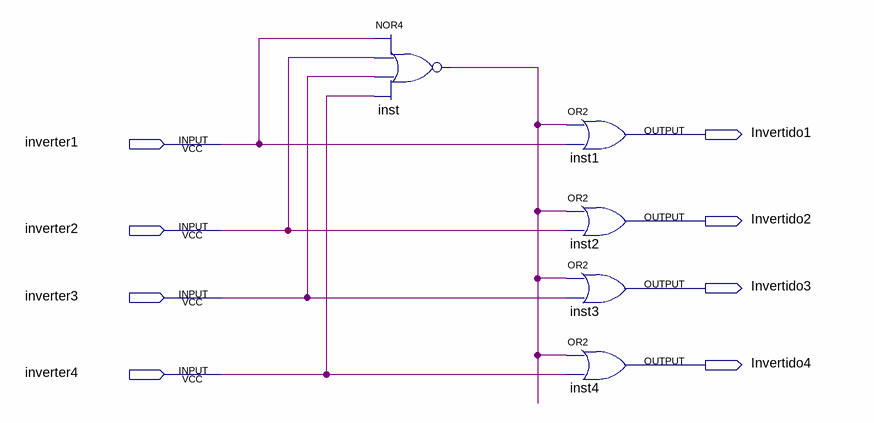
[diagram p0: schematic sheet]
// Quartus schematic InversorPositivo.bdf as structural Verilog: 5 symbols, 8 pins
module InversorPositivo (
  input  inverter1,
  input  inverter2,
  input  inverter3,
  input  inverter4,
  output Invertido1,
  output Invertido2,
  output Invertido3,
  output Invertido4
);

  wire inst_out;

  nor inst (inst_out, inverter1, inverter2, inverter3, inverter4);
  or inst1 (Invertido1, inst_out, inverter1);
  or inst2 (Invertido2, inst_out, inverter2);
  or inst3 (Invertido3, inst_out, inverter3);
  or inst4 (Invertido4, inst_out, inverter4);
endmodule
